# Altium schematic sheet Standard_Bridge.SchDoc: Standard_Bridge
size A4; DrawnBy: Ian Glass; Address1: Auckland Bioengineering; Address2: Institute; Address3: Auckland, 1010; Address4: New Zealand; Revision: 1; SheetNumber: 3; SheetTotal: 4
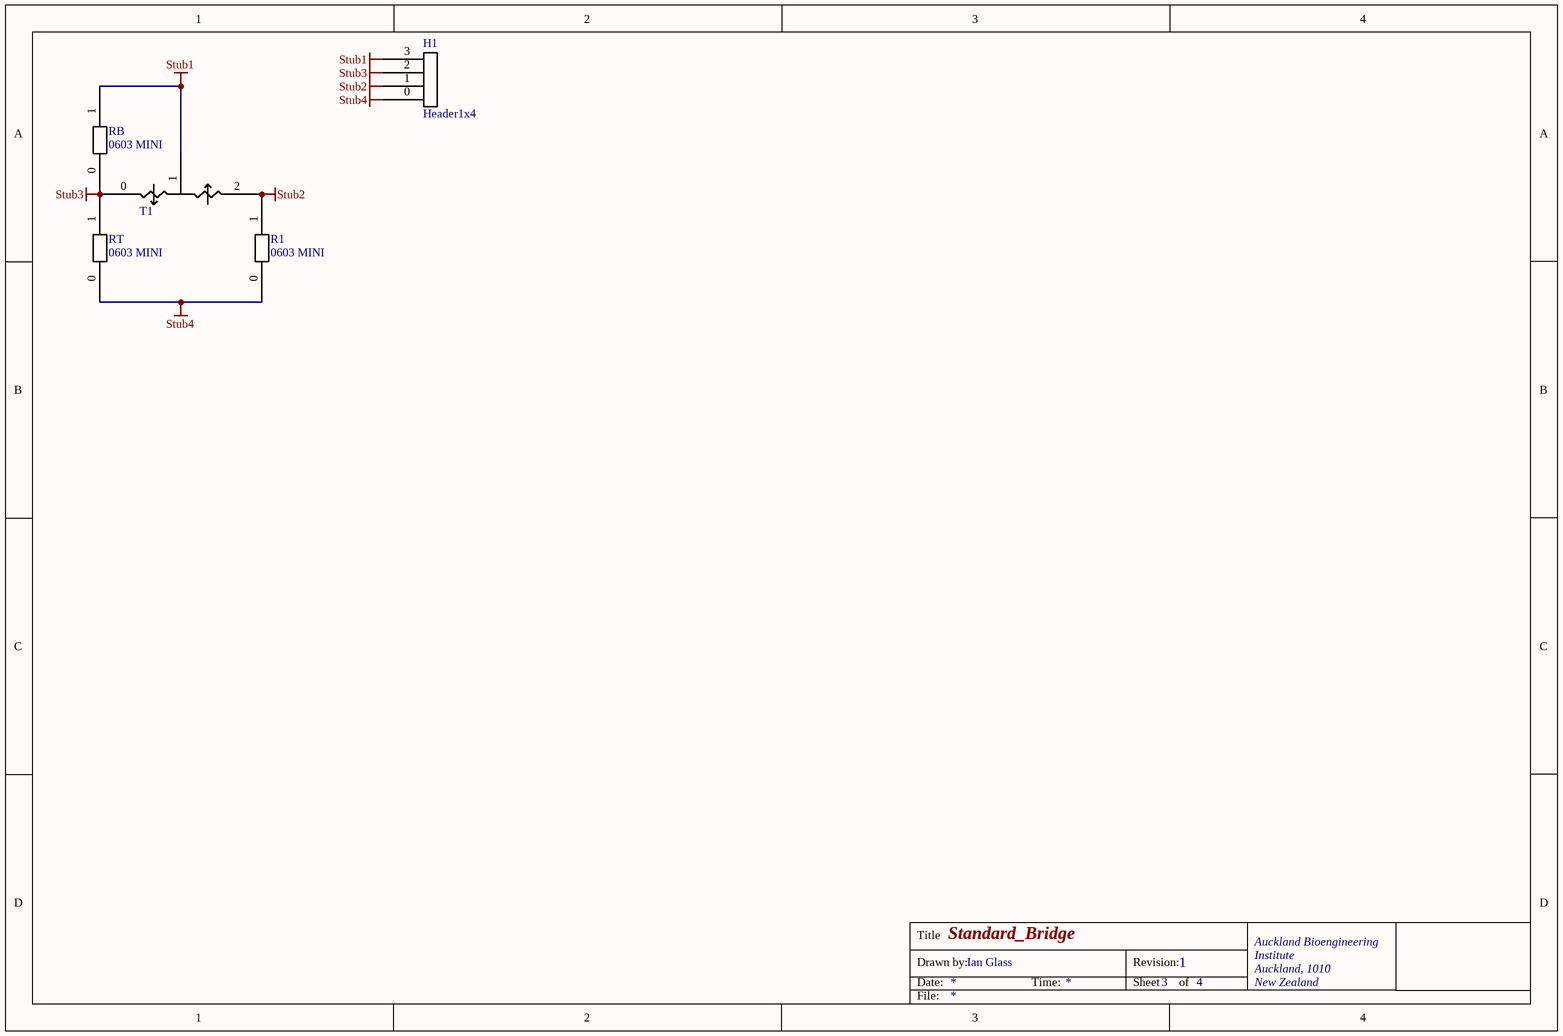
[diagram p0: Standard_Bridge.SchDoc]

## Parts
H1  Header1x4  [Header1x4]
R1  0603 MINI  [0603 MINI]
RB  0603 MINI  [0603 MINI]
RT  0603 MINI  [0603 MINI]
T1  Transducer  [Transducer]  (value not drawn)

## Nets
Stub1: H1.3 RB.1 T1.1
Stub2: H1.1 R1.1 T1.2
Stub3: H1.2 RB.0 RT.1 T1.0
Stub4: H1.0 R1.0 RT.0

## Notes on the sheet
- Title
- Drawn by:
- Date:
- Time:
- Revision:
- Sheet
- of
- File: